# Altium schematic sheet fpga.SCHDOC: Backplane
size B; Engineer: Eric Jonas; Organization: Wilson Lab; Address1: Picower Institute, MIT; Address2: 43 Vassar St. 46-5227; Address3: Cambridge, MA 02139; Address4: Australia 2086
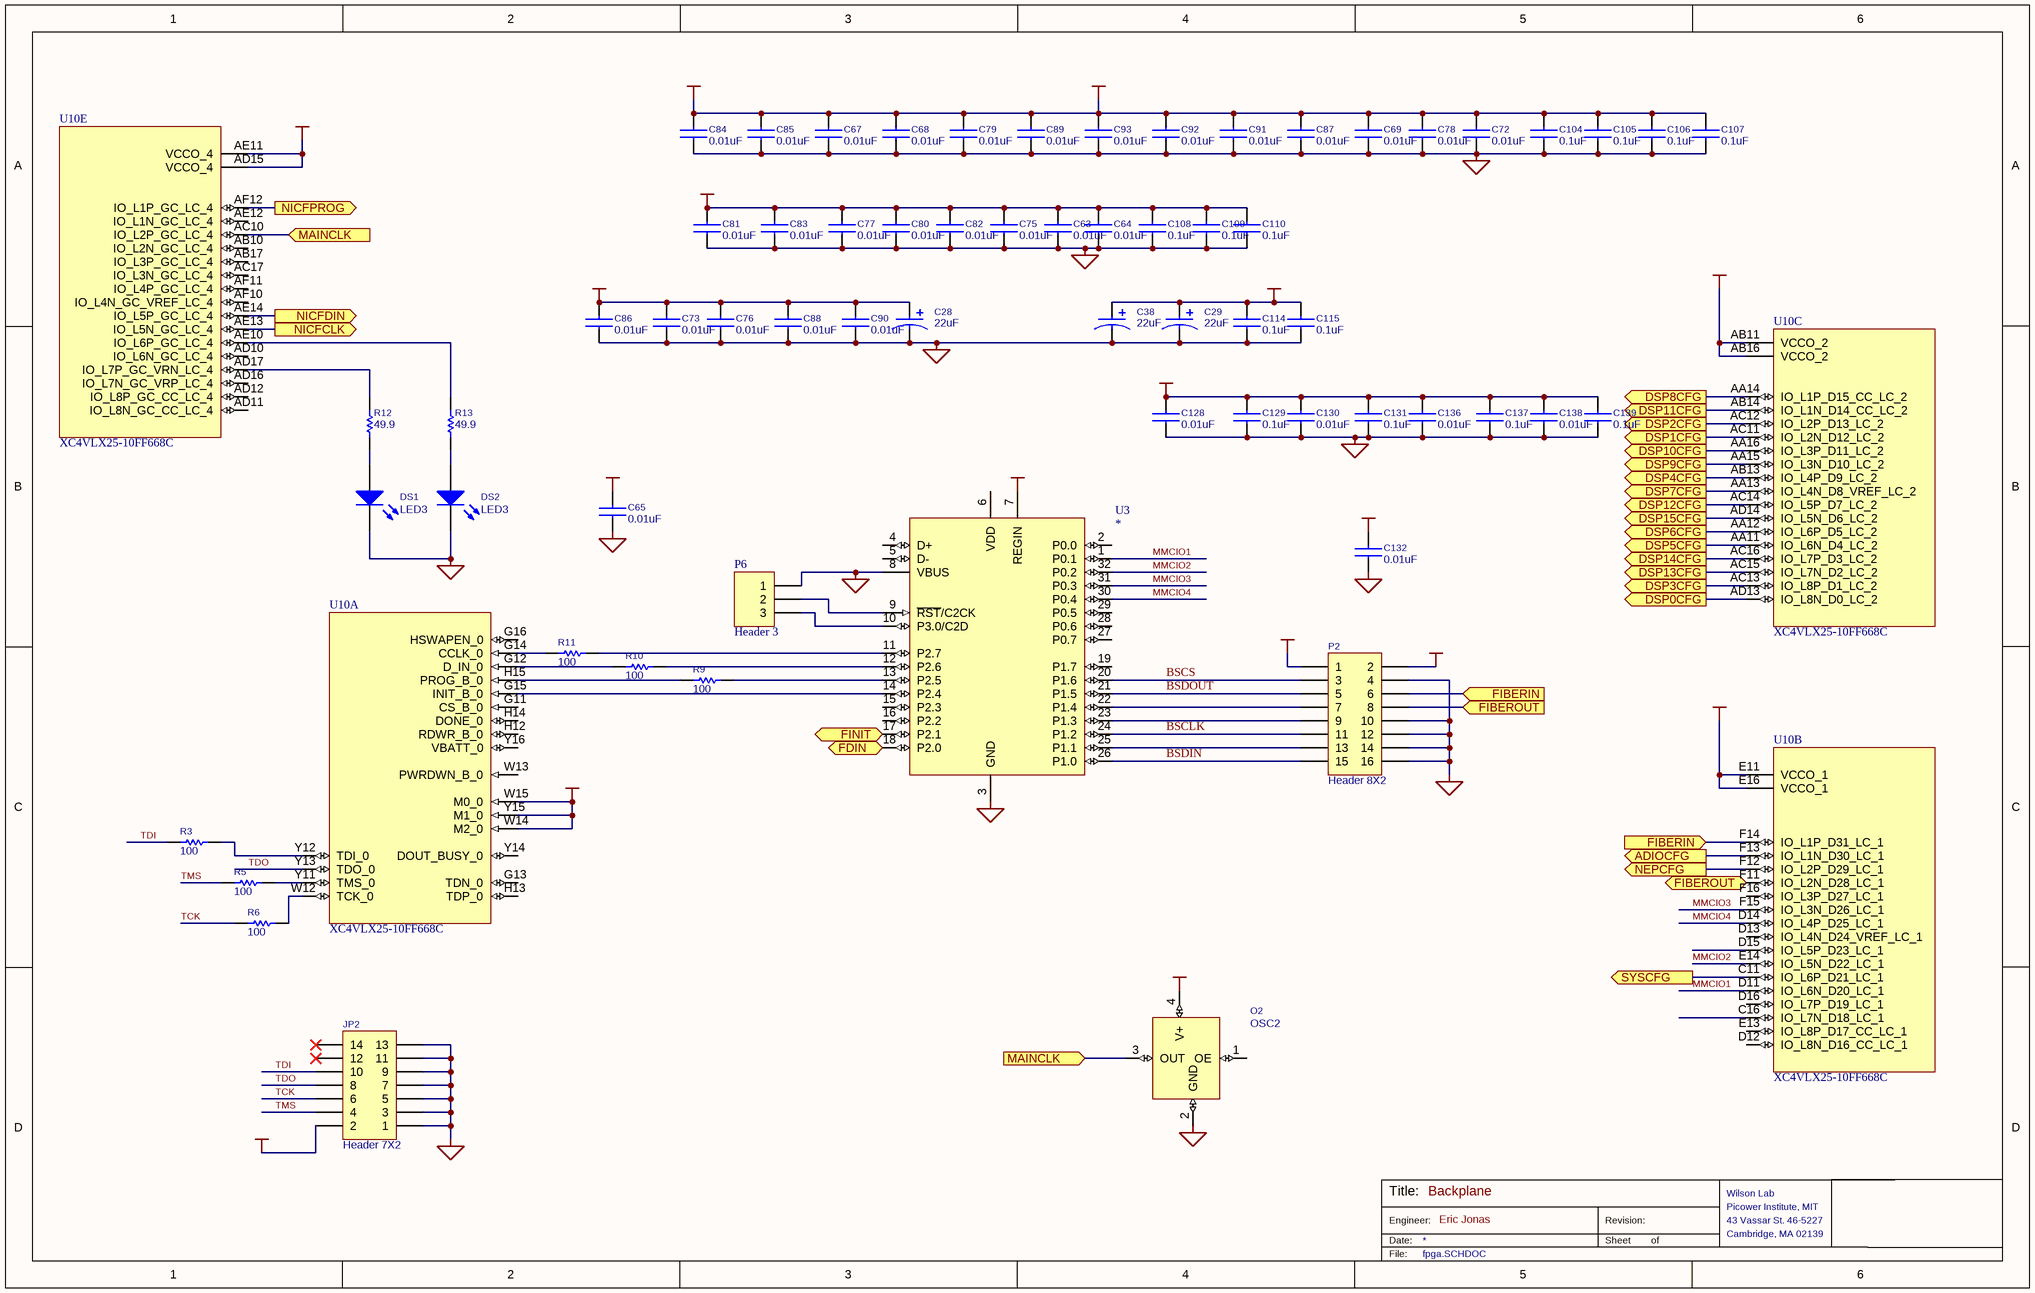
[diagram p0: fpga.SCHDOC]

## Parts
C28  value 22uF  [6032]  (hidden comment: POLCAP2)
C29  value 22uF  [6032]  (hidden comment: POLCAP2)
C38  value 22uF  [6032]  (hidden comment: POLCAP2)
C63  value 0.01uF  [0402]  (hidden comment: CAPACITOR)
C64  value 0.01uF  [0402]  (hidden comment: CAPACITOR)
C65  value 0.01uF  [0402]  (hidden comment: CAPACITOR)
C67  value 0.01uF  [0402]  (hidden comment: CAPACITOR)
C68  value 0.01uF  [0402]  (hidden comment: CAPACITOR)
C69  value 0.01uF  [0402]  (hidden comment: CAPACITOR)
C72  value 0.01uF  [0402]  (hidden comment: CAPACITOR)
C73  value 0.01uF  [0402]  (hidden comment: CAPACITOR)
C75  value 0.01uF  [0402]  (hidden comment: CAPACITOR)
C76  value 0.01uF  [0402]  (hidden comment: CAPACITOR)
C77  value 0.01uF  [0402]  (hidden comment: CAPACITOR)
C78  value 0.01uF  [0402]  (hidden comment: CAPACITOR)
C79  value 0.01uF  [0402]  (hidden comment: CAPACITOR)
C80  value 0.01uF  [0402]  (hidden comment: CAPACITOR)
C81  value 0.01uF  [0402]  (hidden comment: CAPACITOR)
C82  value 0.01uF  [0402]  (hidden comment: CAPACITOR)
C83  value 0.01uF  [0402]  (hidden comment: CAPACITOR)
C84  value 0.01uF  [0402]  (hidden comment: CAPACITOR)
C85  value 0.01uF  [0402]  (hidden comment: CAPACITOR)
C86  value 0.01uF  [0402]  (hidden comment: CAPACITOR)
C87  value 0.01uF  [0402]  (hidden comment: CAPACITOR)
C88  value 0.01uF  [0402]  (hidden comment: CAPACITOR)
C89  value 0.01uF  [0402]  (hidden comment: CAPACITOR)
C90  value 0.01uF  [0402]  (hidden comment: CAPACITOR)
C91  value 0.01uF  [0402]  (hidden comment: CAPACITOR)
C92  value 0.01uF  [0402]  (hidden comment: CAPACITOR)
C93  value 0.01uF  [0402]  (hidden comment: CAPACITOR)
C104  value 0.1uF  [0603]  (hidden comment: CAPACITOR)
C105  value 0.1uF  [0603]  (hidden comment: CAPACITOR)
C106  value 0.1uF  [0603]  (hidden comment: CAPACITOR)
C107  value 0.1uF  [0603]  (hidden comment: CAPACITOR)
C108  value 0.1uF  [0603]  (hidden comment: CAPACITOR)
C109  value 0.1uF  [0603]  (hidden comment: CAPACITOR)
C110  value 0.1uF  [0603]  (hidden comment: CAPACITOR)
C114  value 0.1uF  [0603]  (hidden comment: CAPACITOR)
C115  value 0.1uF  [0603]  (hidden comment: CAPACITOR)
C128  value 0.01uF  [0402]  (hidden comment: CAPACITOR)
C129  value 0.1uF  [0603]  (hidden comment: CAPACITOR)
C130  value 0.01uF  [0402]  (hidden comment: CAPACITOR)
C131  value 0.1uF  [0603]  (hidden comment: CAPACITOR)
C132  value 0.01uF  [0402]  (hidden comment: CAPACITOR)
C136  value 0.01uF  [0402]  (hidden comment: CAPACITOR)
C137  value 0.1uF  [0603]  (hidden comment: CAPACITOR)
C138  value 0.01uF  [0402]  (hidden comment: CAPACITOR)
C139  value 0.1uF  [0603]  (hidden comment: CAPACITOR)
DS1  LED3  [SMD _LED]
DS2  LED3  [SMD _LED]
JP2  Header 7X2  [SMT 2x7 2mm HDR]
O2  OSC2  [ECS-3953M]
P2  Header 8X2  [MOLEX 15-91-2160]
P6  Header 3  [HDR1X3]
R3  value 100  [0603]  (hidden comment: current-limiting series res)
R5  value 100  [0603]  (hidden comment: current-limiting series res)
R6  value 100  [0603]  (hidden comment: current-limiting series res)
R9  value 100  [0603]  (hidden comment: RESISTOR)
R10  value 100  [0603]  (hidden comment: RESISTOR)
R11  value 100  [0603]  (hidden comment: RESISTOR)
R12  value 49.9  [0402]  (hidden comment: current-limiting series res)
R13  value 49.9  [0402]  (hidden comment: current-limiting series res)
U3  *  [QFP7x7-G32/N]
U10  XC4VLX25-10FF668C  [Xilinx FF668]  (parts A,B,C,E of 13)

## Ports
ADIOCFG (out), DSP0CFG (out), DSP1CFG (out), DSP2CFG (out), DSP3CFG (out), DSP4CFG (out), DSP5CFG (out), DSP6CFG (out), DSP7CFG (out), DSP8CFG (out), DSP9CFG (out), DSP10CFG (out), DSP11CFG (out), DSP12CFG (out), DSP13CFG (out), DSP14CFG (out), DSP15CFG (out), FDIN (out), FIBERIN (in), FIBEROUT (in), FINIT (bidir), MAINCLK (in), NEPCFG (out), NICFCLK (out), NICFDIN (out), NICFPROG (out), SYSCFG (out)

## Nets
+0.9VCC: C132.1
+1.2VCC: C28.1 C73.1 C76.1 C86.1 C88.1 C90.1
+1.8VCC: C128.1 C129.1 C130.1 C131.1 C136.1 C137.1 C138.1 C139.1
+2.5VCC: C29.1 C38.1 C67.1 C68.1 C69.1 C72.1 C78.1 C79.1 C84.1 C85.1 C87.1 C89.1 C91.1 C92.1 C93.1 C104.1 C105.1 C106.1 C107.1 C114.1 C115.1
+5VCC: C65.1 P2.2 U3.7(REGIN)
GND: C28.2 C29.2 C38.2 C63.2 C64.2 C65.2 C67.2 C68.2 C69.2 C72.2 C73.2 C75.2 C76.2 C77.2 C78.2 C79.2 C80.2 C81.2 C82.2 C83.2 C84.2 C85.2 C86.2 C87.2 C88.2 C89.2 C90.2 C91.2 C92.2 C93.2 C104.2 C105.2 C106.2 C107.2 C108.2 C109.2 C110.2 C114.2 C115.2 C128.2 C129.2 C130.2 C131.2 C132.2 C136.2 C137.2 C138.2 C139.2 DS1.2(K) DS2.2(K) JP2.1 JP2.3 JP2.5 JP2.7 JP2.9 JP2.11 JP2.13 O2.2(GND) P2.4 P2.10 P2.12 P2.14 P2.16 P6.1 U3.3(GND) U3.8(VBUS)
VCC: C63.1 C64.1 C75.1 C77.1 C80.1 C81.1 C82.1 C83.1 C108.1 C109.1 C110.1 JP2.2 O2.4(V+) P2.1 U10.AB11(VCCO_2) U10.AB16(VCCO_2) U10.AD15(VCCO_4) U10.AE11(VCCO_4) U10.E11(VCCO_1) U10.E16(VCCO_1) U10.W14(M2_0) U10.W15(M0_0) U10.Y15(M1_0)
ADIOCFG: U10.F13(IO_L1N_D30_LC_1) ; port ADIOCFG
BSCLK: P2.11 U3.24(P1.2)
BSCS: P2.3 U3.20(P1.6)
BSDIN: P2.15 U3.26(P1.0)
BSDOUT: P2.5 U3.21(P1.5)
DSP0CFG: U10.AD13(IO_L8N_D0_LC_2) ; port DSP0CFG
DSP1CFG: U10.AC11(IO_L2N_D12_LC_2) ; port DSP1CFG
DSP2CFG: U10.AC12(IO_L2P_D13_LC_2) ; port DSP2CFG
DSP3CFG: U10.AC13(IO_L8P_D1_LC_2) ; port DSP3CFG
DSP4CFG: U10.AB13(IO_L4P_D9_LC_2) ; port DSP4CFG
DSP5CFG: U10.AA11(IO_L6N_D4_LC_2) ; port DSP5CFG
DSP6CFG: U10.AA12(IO_L6P_D5_LC_2) ; port DSP6CFG
DSP7CFG: U10.AA13(IO_L4N_D8_VREF_LC_2) ; port DSP7CFG
DSP8CFG: U10.AA14(IO_L1P_D15_CC_LC_2) ; port DSP8CFG
DSP9CFG: U10.AA15(IO_L3N_D10_LC_2) ; port DSP9CFG
DSP10CFG: U10.AA16(IO_L3P_D11_LC_2) ; port DSP10CFG
DSP11CFG: U10.AB14(IO_L1N_D14_CC_LC_2) ; port DSP11CFG
DSP12CFG: U10.AC14(IO_L5P_D7_LC_2) ; port DSP12CFG
DSP13CFG: U10.AC15(IO_L7N_D2_LC_2) ; port DSP13CFG
DSP14CFG: U10.AC16(IO_L7P_D3_LC_2) ; port DSP14CFG
DSP15CFG: U10.AD14(IO_L5N_D6_LC_2) ; port DSP15CFG
FDIN: U3.18(P2.0) ; port FDIN
FIBERIN: P2.6 U10.F14(IO_L1P_D31_LC_1) ; port FIBERIN
FIBEROUT: P2.8 U10.F11(IO_L2N_D28_LC_1) ; port FIBEROUT
FINIT: U3.17(P2.1) ; port FINIT
MAINCLK: O2.3(OUT) U10.AC10(IO_L2P_GC_LC_4) ; port MAINCLK
MMCIO1: U3.1(P0.1) U10.D11(IO_L6N_D20_LC_1)
MMCIO2: U3.32(P0.2) U10.E14(IO_L5N_D22_LC_1)
MMCIO3: U3.31(P0.3) U10.F15(IO_L3N_D26_LC_1)
MMCIO4: U3.30(P0.4) U10.D14(IO_L4P_D25_LC_1)
NEPCFG: U10.F12(IO_L2P_D29_LC_1) ; port NEPCFG
NICFCLK: U10.AE13(IO_L5N_GC_LC_4) ; port NICFCLK
NICFDIN: U10.AE14(IO_L5P_GC_LC_4) ; port NICFDIN
NICFPROG: U10.AF12(IO_L1P_GC_LC_4) ; port NICFPROG
SYSCFG: U10.C11(IO_L6P_D21_LC_1) ; port SYSCFG
TCK: JP2.6 R6.1
TDI: JP2.10 R3.2
TDO: JP2.8 U10.Y13(TDO_0)
TMS: JP2.4 R5.2
NetDS1_1: DS1.1(A) R12.2
NetDS2_1: DS2.1(A) R13.2
NetP2_7: P2.7 U3.22(P1.4)
NetP2_9: P2.9 U3.23(P1.3)
NetP2_13: P2.13 U3.25(P1.1)
NetP6_2: P6.2 U3.9(~{RST}/C2CK)
NetP6_3: P6.3 U3.10(P3.0/C2D)
NetR3_1: R3.1 U10.Y12(TDI_0)
NetR5_1: R5.1 U10.Y11(TMS_0)
NetR6_2: R6.2 U10.W12(TCK_0)
NetR9_1: R9.1 U3.13(P2.5)
NetR9_2: R9.2 U10.H15(PROG_B_0)
NetR10_1: R10.1 U3.12(P2.6)
NetR10_2: R10.2 U10.G12(D_IN_0)
NetR11_1: R11.1 U3.11(P2.7)
NetR11_2: R11.2 U10.G14(CCLK_0)
NetR12_1: R12.1 U10.AD17(IO_L7P_GC_VRN_LC_4)
NetR13_1: R13.1 U10.AE10(IO_L6P_GC_LC_4)
NetU3_14: U3.14(P2.4) U10.G15(INIT_B_0)

Not connected (* = marked no-connect by the designer): JP2 12* 14*; O2 1(OE); U3 2(P0.0) 4(D+) 5(D-) 6(VDD) 15(P2.3) 16(P2.2) 19(P1.7) 27(P0.7) 28(P0.6) 29(P0.5); U10 AB10(IO_L2N_GC_LC_4) AB17(IO_L3P_GC_LC_4) AC17(IO_L3N_GC_LC_4) AD10(IO_L6N_GC_LC_4) AD11(IO_L8N_GC_CC_LC_4) AD12(IO_L8P_GC_CC_LC_4) AD16(IO_L7N_GC_VRP_LC_4) AE12(IO_L1N_GC_LC_4) AF10(IO_L4N_GC_VREF_LC_4) AF11(IO_L4P_GC_LC_4) C16(IO_L7N_D18_LC_1) D12(IO_L8N_D16_CC_LC_1) D13(IO_L4N_D24_VREF_LC_1) D15(IO_L5P_D23_LC_1) D16(IO_L7P_D19_LC_1) E13(IO_L8P_D17_CC_LC_1) F16(IO_L3P_D27_LC_1) G11(CS_B_0) G13(TDN_0) G16(HSWAPEN_0) H12(RDWR_B_0) H13(TDP_0) H14(DONE_0) W13(PWRDWN_B_0) Y14(DOUT_BUSY_0) Y16(VBATT_0)

## Notes on the sheet
- Labels drawn without touching a wire or pin: VCC
- Title:
- Engineer:
- Date:
- Revision:
- Sheet
- of
- File:

## Library data of the parts
C28 C29 C38 = POLCAP2: Standard Capacitor
C63-C65 C67-C69 C72 C73 C75-C93 C104-C110 C114 C115 C128-C132 C136-C139 = CAPACITOR: Standard Capacitor
DS1 DS2 = LED3: Typical BLUE SiC LED; Published: 8-Jun-2000; LatestRevisionDate: 17-Dec-2003; LatestRevisionNote: PCB Footprint replaced.; Publisher: Altium Limited
JP2 = Header 7X2: Header, 7-Pin, Dual row; Manufacturer: Generic Components; Class I: Connector; Revision: July-2002: Re-released for DXP Platform.; Publisher: Altium Limited
O2 = OSC2: ECS SMD Oscillator, ECS-3953M; Part: SG-636PCE 30.0000MC0
P2 = Header 8X2: Header, 8-Pin, Dual row; LatestRevisionDate: 17-Jul-2002; LatestRevisionNote: Re-released for DXP Platform.; Publisher: Altium Limited
P6 = Header 3: Header, 3-Pin; LatestRevisionDate: 17-Jul-2002; LatestRevisionNote: Re-released for DXP Platform.; Publisher: Altium Limited
R3 R5 R6 R9-R11 = RESISTOR: Standard Passive Resistor; Tolerance: 1%
R12 R13 = RESISTOR: Standard Passive Resistor; 50: Value; Tolerance: 1%
U3 = C8051F342/3/6/7: SiLiabs USB Micro
U10 = XC4VLX25-10FF668C: Xilinx Virtex-4